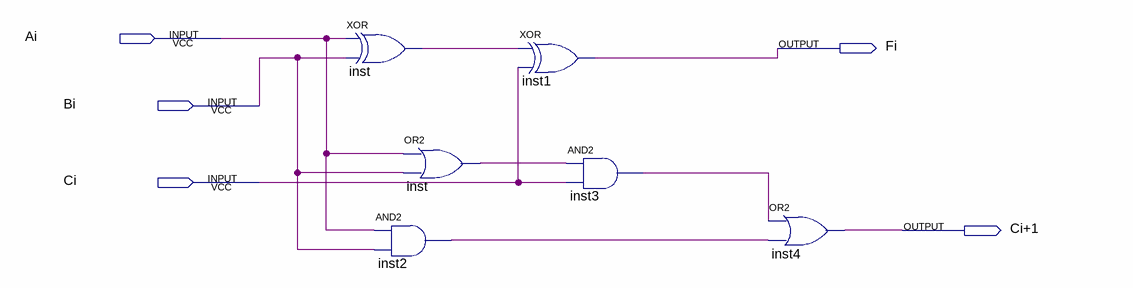
[diagram p0: schematic sheet]
// Quartus schematic ADD1.bdf as structural Verilog: 6 symbols, 5 pins
module ADD1 (
  input  Ai,
  input  Bi,
  input  Ci,
  output Fi,
  output \Ci+1 
);

  wire inst2_out, inst3_out, inst_out, inst_out_2;

  xor inst (inst_out_2, Ai, Bi);
  or inst_dup2 (inst_out, Ai, Bi);
  and inst2 (inst2_out, Ai, Bi);
  xor inst1 (Fi, inst_out_2, Ci);
  and inst3 (inst3_out, inst_out, Ci);
  or inst4 (\Ci+1 , inst3_out, inst2_out);
endmodule
